# Altium schematic sheet 7.2 VA_PROTECTSchDoc.SchDoc: 6.6kW Daul OBC +11kW WPT
size A2; Revision: V 1.0; SheetNumber: 8; SheetTotal: 14; ImagePath: 0
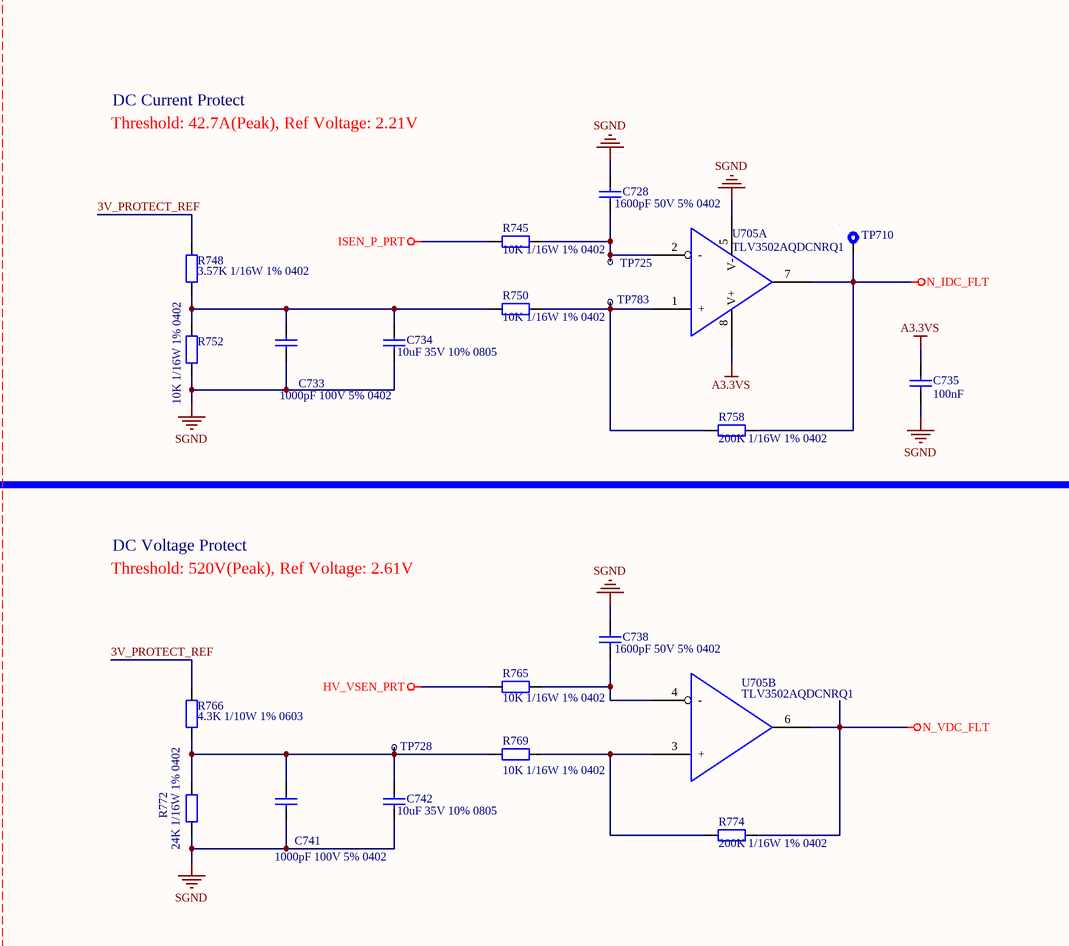
[diagram p0: 7.2 VA_PROTECTSchDoc.SchDoc, top left]
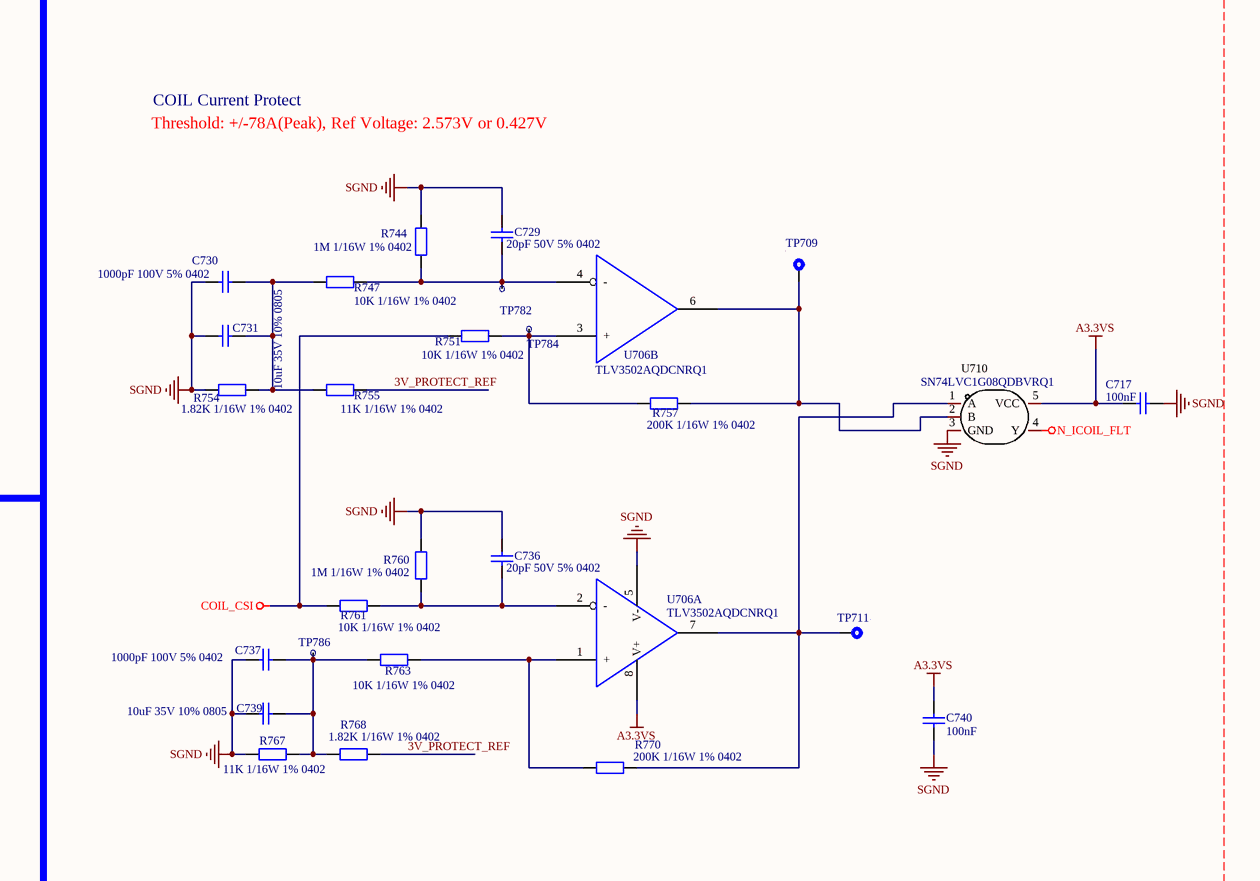
[diagram p1: 7.2 VA_PROTECTSchDoc.SchDoc, top right]
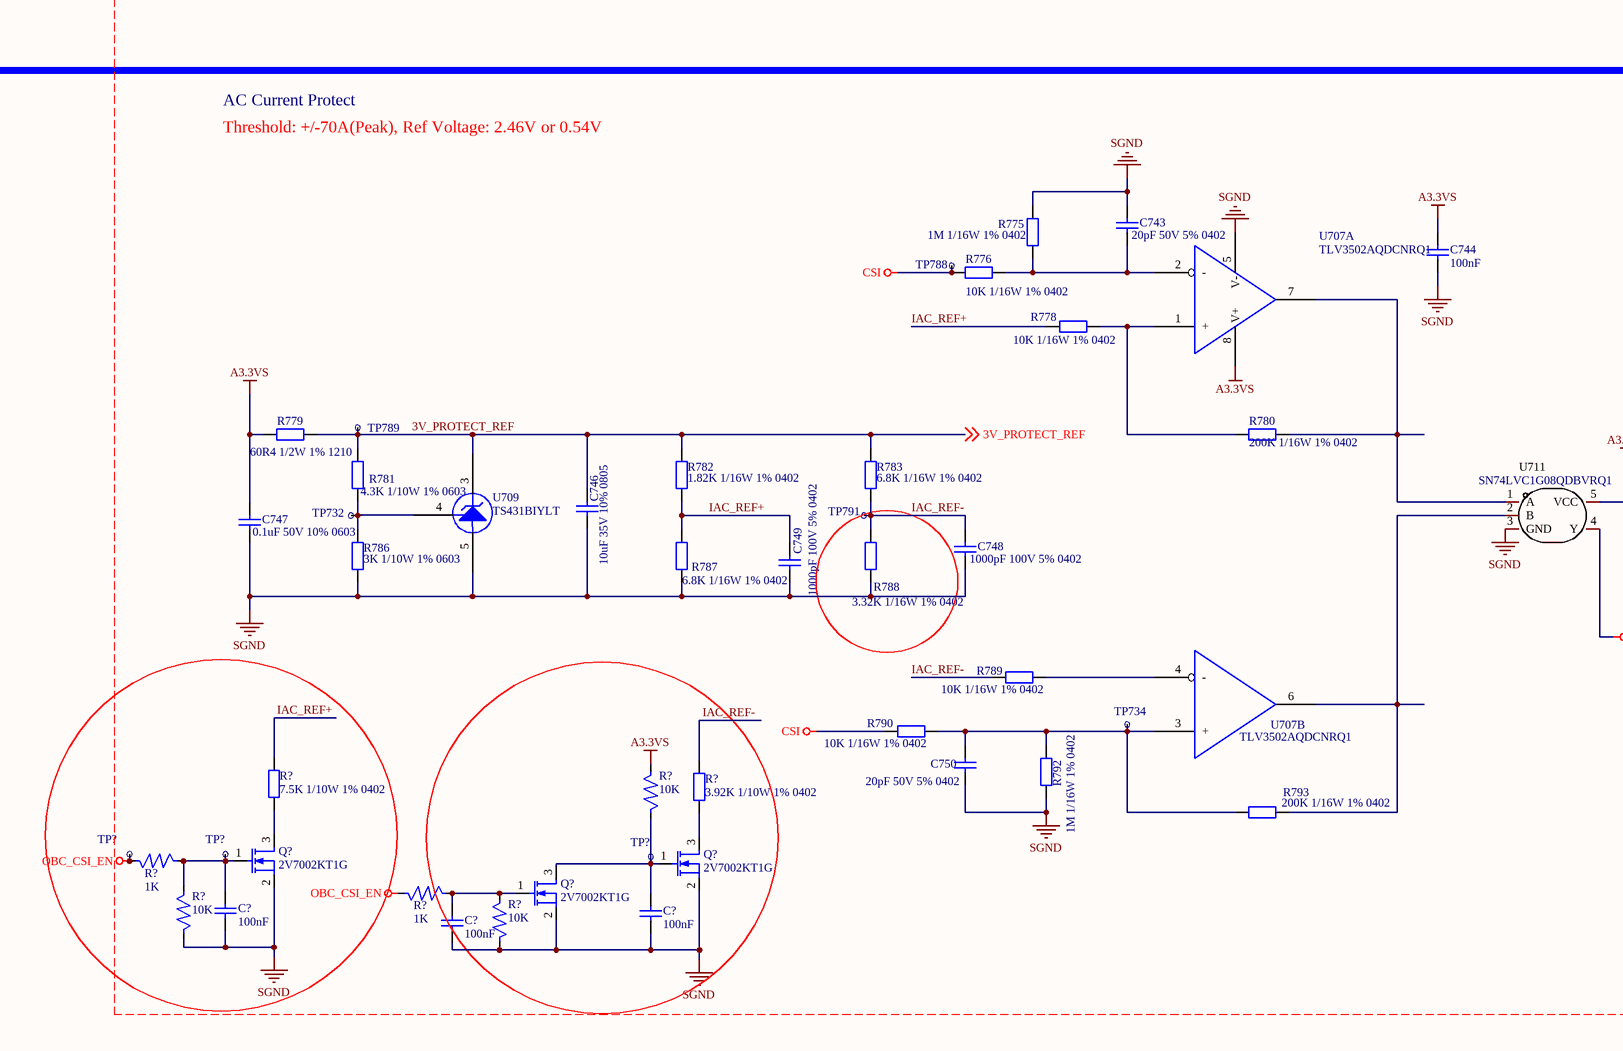
[diagram p2: 7.2 VA_PROTECTSchDoc.SchDoc, bottom left]
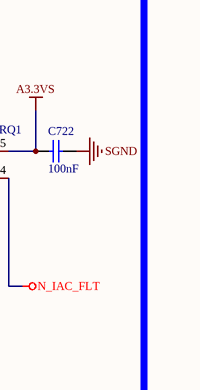
[diagram p3: 7.2 VA_PROTECTSchDoc.SchDoc, bottom right]

## Parts
(Parts that share a designator on the sheet are numbered #1, #2 ... from top to bottom, then left to right.)
C717  100nF  [C0402]
C722  100nF  [C0402]
C728  1600pF 50V 5% 0402  [C0402]
C729  20pF 50V 5% 0402  [C0402]
C730  1000pF 100V 5% 0402  [C0402]
C731  10uF 35V 10% 0805  [C0805]
C733  1000pF 100V 5% 0402  [C0402]
C734  10uF 35V 10% 0805  [C0805]
C735  100nF  [C0402]
C736  20pF 50V 5% 0402  [C0402]
C737  1000pF 100V 5% 0402  [C0402]
C738  1600pF 50V 5% 0402  [C0402]
C739  10uF 35V 10% 0805  [C0805]
C740  100nF  [C0402]
C741  1000pF 100V 5% 0402  [C0402]
C742  10uF 35V 10% 0805  [C0805]
C743  20pF 50V 5% 0402  [C0402]
C744  100nF  [C0402]
C746  10uF 35V 10% 0805  [C0805]
C747  0.1uF 50V 10% 0603  [C0603]
C748  1000pF 100V 5% 0402  [C0402]
C749  1000pF 100V 5% 0402  [C0402]
C750  20pF 50V 5% 0402  [C0402]
C?#1  100nF  [C0402]
C?#2  100nF  [C0402]
C?#3  100nF  [C0402]
Q?#1  2V7002KT1G  [Q_SOT23 - 2]
Q?#2  2V7002KT1G  [Q_SOT23 - 2]
Q?#3  2V7002KT1G  [Q_SOT23 - 2]
R744  1M 1/16W 1% 0402  [R0402]
R745  10K 1/16W 1% 0402  [R0402]
R747  10K 1/16W 1% 0402  [R0402]
R748  3.57K 1/16W 1% 0402  [R0402]
R750  10K 1/16W 1% 0402  [R0402]
R751  10K 1/16W 1% 0402  [R0402]
R752  10K 1/16W 1% 0402  [R0402]
R754  1.82K 1/16W 1% 0402  [R0402]
R755  11K 1/16W 1% 0402  [R0402]
R757  200K 1/16W 1% 0402  [R0402]
R758  200K 1/16W 1% 0402  [R0402]
R760  1M 1/16W 1% 0402  [R0402]
R761  10K 1/16W 1% 0402  [R0402]
R763  10K 1/16W 1% 0402  [R0402]
R765  10K 1/16W 1% 0402  [R0402]
R766  4.3K 1/10W 1% 0603  [R0603]
R767  11K 1/16W 1% 0402  [R0402]
R768  1.82K 1/16W 1% 0402  [R0402]
R769  10K 1/16W 1% 0402  [R0402]
R770  200K 1/16W 1% 0402  [R0402]
R772  24K 1/16W 1% 0402  [R0402]
R774  200K 1/16W 1% 0402  [R0402]
R775  1M 1/16W 1% 0402  [R0402]
R776  10K 1/16W 1% 0402  [R0402]
R778  10K 1/16W 1% 0402  [R0402]
R779  60R4 1/2W 1% 1210  [R1210]
R780  200K 1/16W 1% 0402  [R0402]
R781  4.3K 1/10W 1% 0603  [R0603]
R782  1.82K 1/16W 1% 0402  [R0402]
R783  6.8K 1/16W 1% 0402  [R0402]
R786  3K 1/10W 1% 0603  [R0603]
R787  6.8K 1/16W 1% 0402  [R0402]
R788  3.32K 1/16W 1% 0402  [R0402]
R789  10K 1/16W 1% 0402  [R0402]
R790  10K 1/16W 1% 0402  [R0402]
R792  1M 1/16W 1% 0402  [R0402]
R793  200K 1/16W 1% 0402  [R0402]
R?#1  10K  [R0402]
R?#2  7.5K 1/10W 1% 0402  [R0402]
R?#3  3.92K 1/10W 1% 0402  [R0402]
R?#4  1K  [R0402]
R?#5  10K  [R0402]
R?#6  1K  [R0402]
R?#7  10K  [R0402]
TP709  测试点  [测试点]  (value not drawn)
TP710  测试点  [测试点]  (value not drawn)
TP711  测试点  [测试点]  (value not drawn)
TP725  测试点  [测试点]  (value not drawn)
TP728  测试点  [测试点]  (value not drawn)
TP732  测试点  [测试点]  (value not drawn)
TP734  测试点  [测试点]  (value not drawn)
TP782  测试点  [测试点]  (value not drawn)
TP783  测试点  [测试点]  (value not drawn)
TP784  测试点  [测试点]  (value not drawn)
TP786  测试点  [测试点]  (value not drawn)
TP788  测试点  [测试点]  (value not drawn)
TP789  测试点  [测试点]  (value not drawn)
TP791  测试点  [测试点]  (value not drawn)
TP?#1  测试点  [测试点]  (value not drawn)
TP?#2  测试点  [测试点]  (value not drawn)
TP?#3  测试点  [测试点]  (value not drawn)
U705  TLV3502AQDCNRQ1  [SON-8]  (parts A,B of 2)
U706  TLV3502AQDCNRQ1  [SO8N]  (parts A,B of 2)
U707  TLV3502AQDCNRQ1  [SO8N]  (parts A,B of 2)
U709  TS431BIYLT  [SOT23-5]
U710  SN74LVC1G08QDBVRQ1  [SOT23-5]
U711  SN74LVC1G08QDBVRQ1  [SOT23-5]

## Nets
A3.3VS: C717.2 C722.1 C735.1 C740.1 C744.1 C747.1 R779.1 R?#1.1 U705.8(V+) U706.8(V+) U707.8(V+) U710.5(VCC) U711.5(VCC)
COIL_CSI: R751.1 R761.1
CSI: R776.1 R790.1 TP788.1
HV_VSEN_PRT: R765.1
ISEN_P_PRT: R745.1
N_IAC_FLT: U711.4(Y)
N_ICOIL_FLT: U710.4(Y)
N_IDC_FLT: R758.2 TP710.1 U705.7
N_VDC_FLT: R774.2 U705.6
OBC_CSI_EN: R?#4.2 R?#6.2 TP?#1.1
SGND: C717.1 C722.2 C728.2 C729.2 C730.2 C731.1 C733.1 C734.2 C735.2 C736.2 C737.2 C738.2 C739.1 C740.2 C741.1 C742.2 C743.2 C744.2 C746.2 C747.2 C748.1 C749.1 C750.1 C?#1.2 C?#2.2 C?#3.2 Q?#1.2(S) Q?#2.2(S) Q?#3.2(S) R744.2 R752.2 R754.1 R760.2 R767.1 R772.2 R775.2 R786.2 R787.2 R788.2 R792.1 R?#5.2 R?#7.2 U705.5(V-) U706.5(V-) U707.5(V-) U709.5 U710.3(GND) U711.3(GND)
3V_PROTECT_REF: C746.1 R748.1 R755.2 R766.1 R768.2 R779.2 R781.1 R782.1 R783.1 TP789.1 U709.3 ; off-sheet 3V_PROTECT_REF
IAC_REF+: C749.2 R778.1 R782.2 R787.1 R?#2.1
IAC_REF-: C748.2 R783.2 R788.1 R789.1 R?#3.1 TP791.1
NetC728_1: C728.1 R745.2 TP725.1 U705.2(-)
NetC729_1: C729.1 R744.1 R747.2 TP782.1 U706.4(-)
NetC730_1: C730.1 C731.2 R747.1 R754.2 R755.1
NetC733_2: C733.2 C734.1 R748.2 R750.1 R752.1
NetC736_1: C736.1 R760.1 R761.2 U706.2(-)
NetC737_1: C737.1 C739.2 R763.1 R767.2 R768.1 TP786.1
NetC738_1: C738.1 R765.2 U705.4(-)
NetC741_2: C741.2 C742.1 R766.2 R769.1 R772.1 TP728.1
NetC743_1: C743.1 R775.1 R776.2 U707.2(-)
NetC750_2: C750.2 R790.2 R792.2 R793.1 TP734.1 U707.3(+)
NetC?#1_1: C?#1.1 Q?#1.1(G) R?#4.1 R?#5.1 TP?#2.1
NetC?#2_1: C?#2.1 Q?#2.1(G) Q?#3.3(D) R?#1.2 TP?#3.1
NetC?#3_1: C?#3.1 Q?#3.1(G) R?#6.1 R?#7.1
NetQ?#1_3: Q?#1.3(D) R?#2.2
NetQ?#2_3: Q?#2.3(D) R?#3.2
NetR750_2: R750.2 R758.1 TP783.1 U705.1(+)
NetR751_2: R751.2 R757.1 TP784.1 U706.3(+)
NetR757_2: R757.2 TP709.1 U706.6 U710.2(B)
NetR763_2: R763.2 R770.1 U706.1(+)
NetR769_2: R769.2 R774.1 U705.3(+)
NetR770_2: R770.2 TP711.1 U706.7 U710.1(A)
NetR778_2: R778.2 R780.1 U707.1(+)
NetR780_2: R780.2 U707.7 U711.1(A)
NetR781_2: R781.2 R786.1 TP732.1 U709.4
NetR789_2: R789.2 U707.4(-)
NetR793_2: R793.2 U707.6 U711.2(B)

## Layout directives
net class SEC-50V: 3V_PROTECT_REF, A3.3VS, COIL_CSI, CSI, HV_VSEN_PRT, IAC_REF+, IAC_REF-, ISEN_P_PRT, N_IAC_FLT, N_ICOIL_FLT, N_IDC_FLT, N_VDC_FLT, OBC_CSI_EN, SGND

## Notes on the sheet
- Threshold: 42.7A(Peak), Ref Voltage: 2.21V
- DC Current Protect
- Threshold: +/-78A(Peak), Ref Voltage: 2.573V or 0.427V
- COIL Current Protect
- DC Voltage Protect
- Threshold: 520V(Peak), Ref Voltage: 2.61V
- AC Current Protect
- Threshold: +/-70A(Peak), Ref Voltage: 2.46V or 0.54V

## Library data of the parts
C717 C722 C735 C740 C744 C?#1-C?#3 = Cap: Manufacturer: Yageo; Manufacturer P/N: AC0402KRX7R9BB104; DIP/SMD: SMD
C728 C738 = Cap Semi: CAP CER 1600pF 50V 5% X7R 0402 AEC-Q200 SMD; 厂商: Murata; 规格: GRM155R71H162JA01D
C729 C736 C743 C750 = Cap Semi: CAP CER 20pF 50V 5% C0G/NP0 0402 AEC-Q200 SMD; 厂商: Taiyo; 规格: UMK105CG200JVHF
C730 C733 C737 C741 C748 C749 = Cap Semi: CAP CER 1000pF 100V 5% X7R 0402 AEC-Q200 SMD; 厂商: Murata; 规格: GCM155R72A102JA37D
C731 C734 C739 C742 C746 = Cap Semi: CAP CER 10uF 35V 10% X5R 0805 SMD; 厂商: SAMSUNG; 规格: CL21A106KBYQNNE
C747 = Cap Semi: CAP CER 0.1uF 50V 10% X7R 0603 AEC-Q200 SMD; 厂商: SAMSUNG; 规格: CL10B104KB8WPNC
Q?#1-Q?#3 = MOSFET_N CHANNEL: Manufacturer: ONSemi; DIP/SMD: SMD; Manufacturer P/N: 2V7002KT1G
R744 R760 R775 R792 = Res2: RES Thick Film 1M 1/16W 1% 0402 SMD; 厂商: YAGEO; 规格: AC0402FR-071ML
R745 R747 R750 R751 R761 R763 R765 R769 R776 R778 R789 R790 = Res2: RES Thick Film 10K 1/16W 1% 0402 SMD; 厂商: YAGEO; 规格: AC0402FR-0710KL
R748 = Res2: RES Thick Film 3.57K 1/16W 1% 0402 AEC-Q200 SMD; 厂商: YAGEO; 规格: AC0402FR-073K57L
R752 = Res2: RES Thick Film 10K 1/16W 1% 0402 AEC-Q200 SMD; 厂商: YAGEO; 规格: AC0402FR-0710KL
R754 R768 R782 R788 = Res2: RES Thick Film 1.82K 1/16W 1% 0402 AEC-Q200 SMD; 厂商: YAGEO; 规格: AC0402FR-071K82L
R755 R767 = Res2: RES Thick Film 11K 1/16W 1% 0402 AEC-Q200 SMD; 厂商: YAGEO; 规格: AC0402FR-0711KL
R757 R758 R770 R774 R780 R793 = Res2: RES Thick Film 200K 1/16W 1% 0402 AEC-Q200 SMD; 厂商: YAGEO; 规格: AC0402FR-07200KL
R766 R781 = Res2: RES Thick Film 4.3K 1/10W 1% 0603 AEC-Q200 SMD; 厂商: YAGEO; 规格: AC0603FR-074K3L
R772 = Res2: RES Thick Film 24K 1/16W 1% 0402 AEC-Q200 SMD; 厂商: YAGEO; 规格: AC0402FR-0724KL
R779 = Res2: RES Thick Film 60.4 1/2W 1% 1210 AEC-Q200 SMD; 厂商: YAGEO; 规格: AC1210FR-0760R4L
R783 R787 = Res2: RES Thick Film 6.8K 1/16W 1% 0402 AEC-Q200 SMD; 厂商: YAGEO; 规格: AC0402FR-076K8L
R786 = Res2: RES Thick Film 3K 1/10W 1% 0603 AEC-Q200 SMD; 厂商: TA-I; 规格: RMS06FT3001
R?#1 R?#4 R?#6 = RESISTOR_1206: Manufacturer: Yageo; Manufacturer P/N: AC0402FR-0710RL; DIP/SMD: SMD
R?#2 R?#3 = Res2: 厂商: TA-I; 规格: RMS06FT49R9
R?#5 R?#7 = RESISTOR_1206: Manufacturer: Yageo; Manufacturer P/N: AC0402FR-0710KL; DIP/SMD: SMD
TP709-TP711 = Test Point: Test Point 1mm
U705-U707 = TLV3502AQDCNRQ1: IC COMPARATOR 2.7V~5.5V SOT23-8; 厂商: Texas Instruments; 规格: TLV3502AQDCNRQ1
U709 = TS431BIYLT: IC VREF SHUNT ADJ 1.24V~6V 30mA SOT23-5; 厂商: STMicroelectronics; 规格: TS431BIYLT
U710 U711 = SN74LVC1G08QDBVRQ1: Manufacturer: TI(德州仪器); Add into BOM: yes; Logic Gate Type: 与门; Number of Channels: 1; Supply Voltage: 1.65V~5.5V; Quiescent Current (Max): 10uA; Sink Current: 32mA; Propagation Delay Time: 6ns@5V,50pF; Name: SN74LVC1G08QDBVRQ1; Symbol: SN74LVC1G08QDBVRQ1; Device: SN74LVC1G08QDBVRQ1; LCSC Part Name: 与门; Supplier Part: C840098; Manufacturer Part: SN74LVC1G08QDBVRQ1; Supplier Footprint: SOT-23-5; JLCPCB Part Class: Extended Part; Datasheet: https://atta.szlcsc.com/upload/public/pdf/source/20230221/58A14714C9A397E2ED89934BF2BCABE9.pdf; Supplier: LCSC; Convert to PCB: yes; Series: 74LVC; Source Current: 32mA; Operating Temperature: -40℃~+125℃